# Altium schematic sheet sensor.SchDoc
size A4
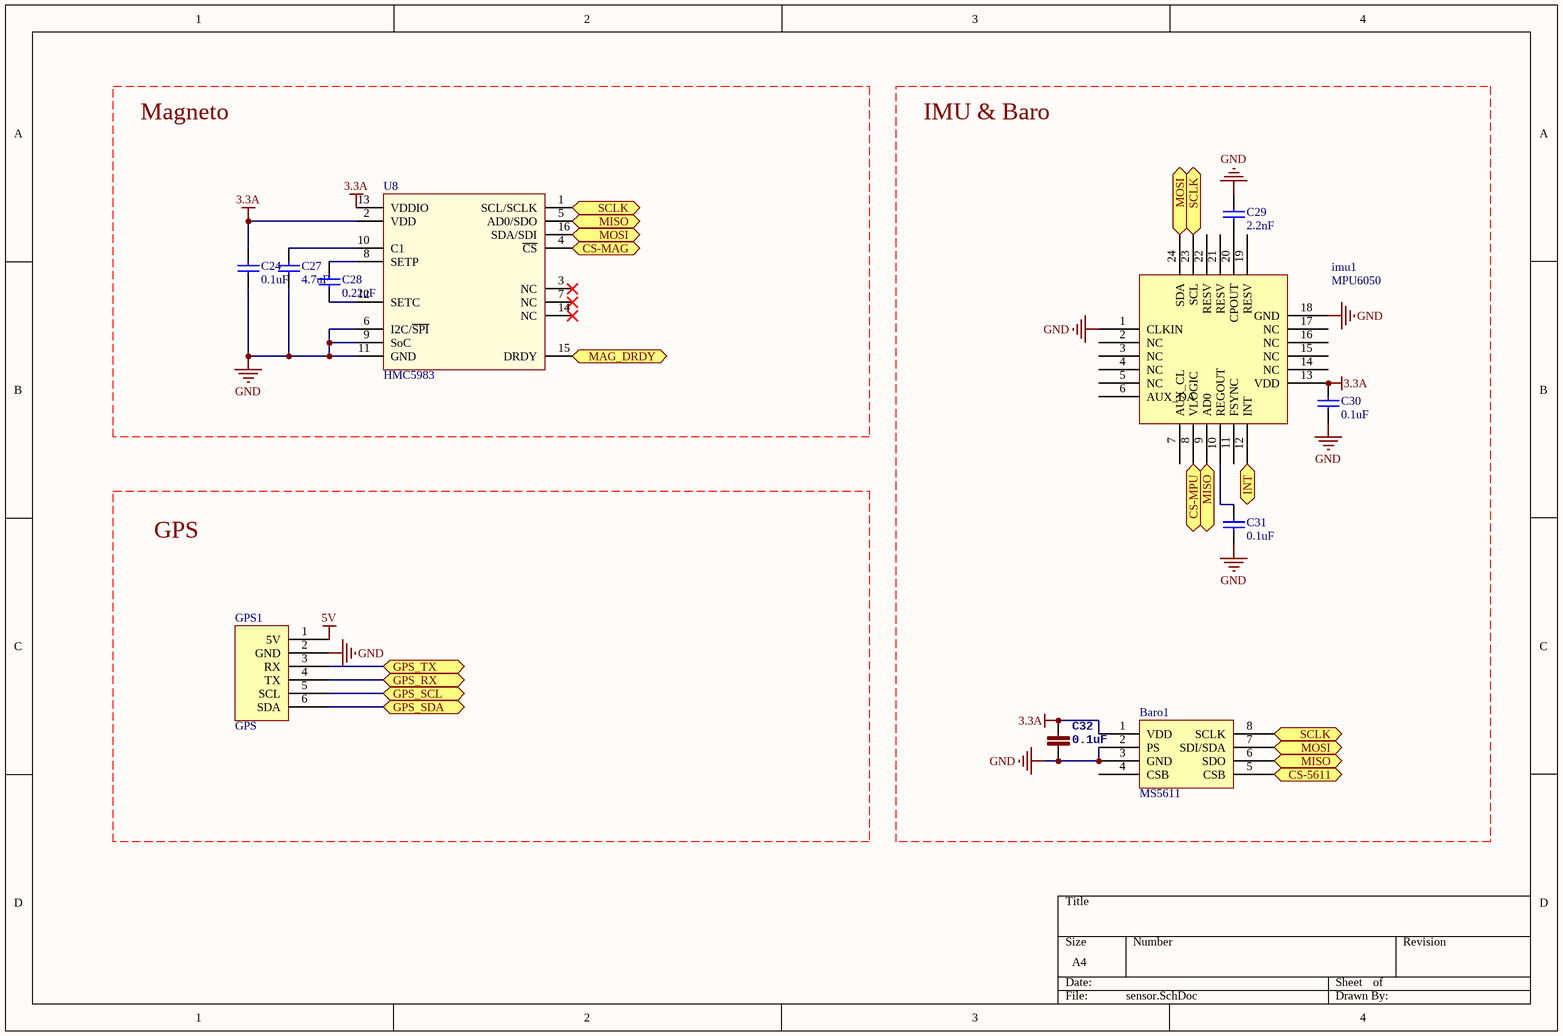
[diagram p0: sensor.SchDoc]

## Parts
Baro1  MS5611  [MS5611]
C24  0.1uF  [0402]
C27  4.7uF  [0805]
C28  0.22uF  [0402]
C29  2.2nF  [0402]
C30  0.1uF  [0402]
C31  0.1uF  [0402]
C32  0.1uF  [0402]
GPS1  GPS  [WFRSM125]
imu1  MPU6050  [MPU6050-2]
U8  HMC5983  [HMC5883-MAN]

## Ports
CS-5611, CS-MAG (bidir), CS-MPU, GPS_RX, GPS_SCL, GPS_SDA, GPS_TX, INT, MAG_DRDY (bidir), MISO, MOSI, SCLK

## Nets
3.3A: Baro1.1(VDD) C24.2 C30.2 C32.1 imu1.13(VDD) U8.2(VDD) U8.13(VDDIO)
5V: GPS1.1(5V)
GND: Baro1.2(PS) Baro1.3(GND) C24.1 C27.1 C29.2 C30.1 C31.1 C32.2 GPS1.2(GND) imu1.1(CLKIN) imu1.18(GND) U8.6(I2C/~{SPI}) U8.9(SoC) U8.11(GND)
CS-5611: Baro1.5(CSB) ; port CS-5611
CS-MAG: U8.4(~{CS}) ; port CS-MAG
CS-MPU: imu1.8(VLOGIC) ; port CS-MPU
GPS_RX: GPS1.4(TX) ; port GPS_RX
GPS_SCL: GPS1.5(SCL) ; port GPS_SCL
GPS_SDA: GPS1.6(SDA) ; port GPS_SDA
GPS_TX: GPS1.3(RX) ; port GPS_TX
INT: imu1.12(INT) ; port INT
MAG_DRDY: U8.15(DRDY) ; port MAG_DRDY
MISO: Baro1.6(SDO) imu1.9(AD0) U8.5(AD0/SDO) ; port MISO
MOSI: Baro1.7(SDI/SDA) imu1.24(SDA) U8.16(SDA/SDI) ; port MOSI
SCLK: Baro1.8(SCLK) imu1.23(SCL) U8.1(SCL/SCLK) ; port SCLK
NetC27_2: C27.2 U8.10(C1)
NetC28_1: C28.1 U8.12(SETC)
NetC28_2: C28.2 U8.8(SETP)
NetC29_1: C29.1 imu1.20(CPOUT)
NetC31_2: C31.2 imu1.10(REGOUT)

Not connected (* = marked no-connect by the designer): Baro1 4(CSB); imu1 2(NC) 3(NC) 4(NC) 5(NC) 6(AUX_DA) 7(AUX_CL) 11(FSYNC) 14(NC) 15(NC) 16(NC) 17(NC) 19(RESV) 21(RESV) 22(RESV); U8 3(NC)* 7(NC)* 14(NC)*

## Notes on the sheet
- Magneto
- IMU & Baro
- GPS

## Library data of the parts
C24 C27 C28 C30 C31 = Cap: Capacitor; Published: 8-Jun-2000; LatestRevisionDate: 17-Jul-2002; LatestRevisionNote: Re-released for DXP Platform.; PackageReference: RAD-0.3; Publisher: Altium Limited; PackageDescription: Radial Cap, Thru-Hole; 2 Leads; 0.3 in Pin Spacing
  C24 C30 C31: Value: 0.1uf
C29 = Cap: Capacitor; Value: 0.1uf; Published: 8-Jun-2000; LatestRevisionDate: 17-Jul-2002; LatestRevisionNote: Re-released for DXP Platform.; PackageReference: RAD-0.3; Publisher: Altium Limited; PackageDescription: Radial Cap, Thru-Hole; 2 Leads; 0.3 in Pin Spacing
C32 = CAP0402-CAP: <b>Capacitor</b> / Standard 0603 ceramic capacitor, and 0.1" leaded capacitor.; PARTNO: CC0402ZRY5V7BB104
U8 = HMC5983: HMC5983 LPCC-16 MEGA